# EasyEDA Pro project ProPrj_measure_boardd_2025-05-07.epro

# Schematic Schematic1
Board Name: Board1; Create Date: 2025-02-12; Page Name: P1; Project Name: measure_boardd; Schematic Name: Schematic1; Update Date: 2025-05-06; Company: EasyEDA.com; Page Size: A4; Version: V1.0
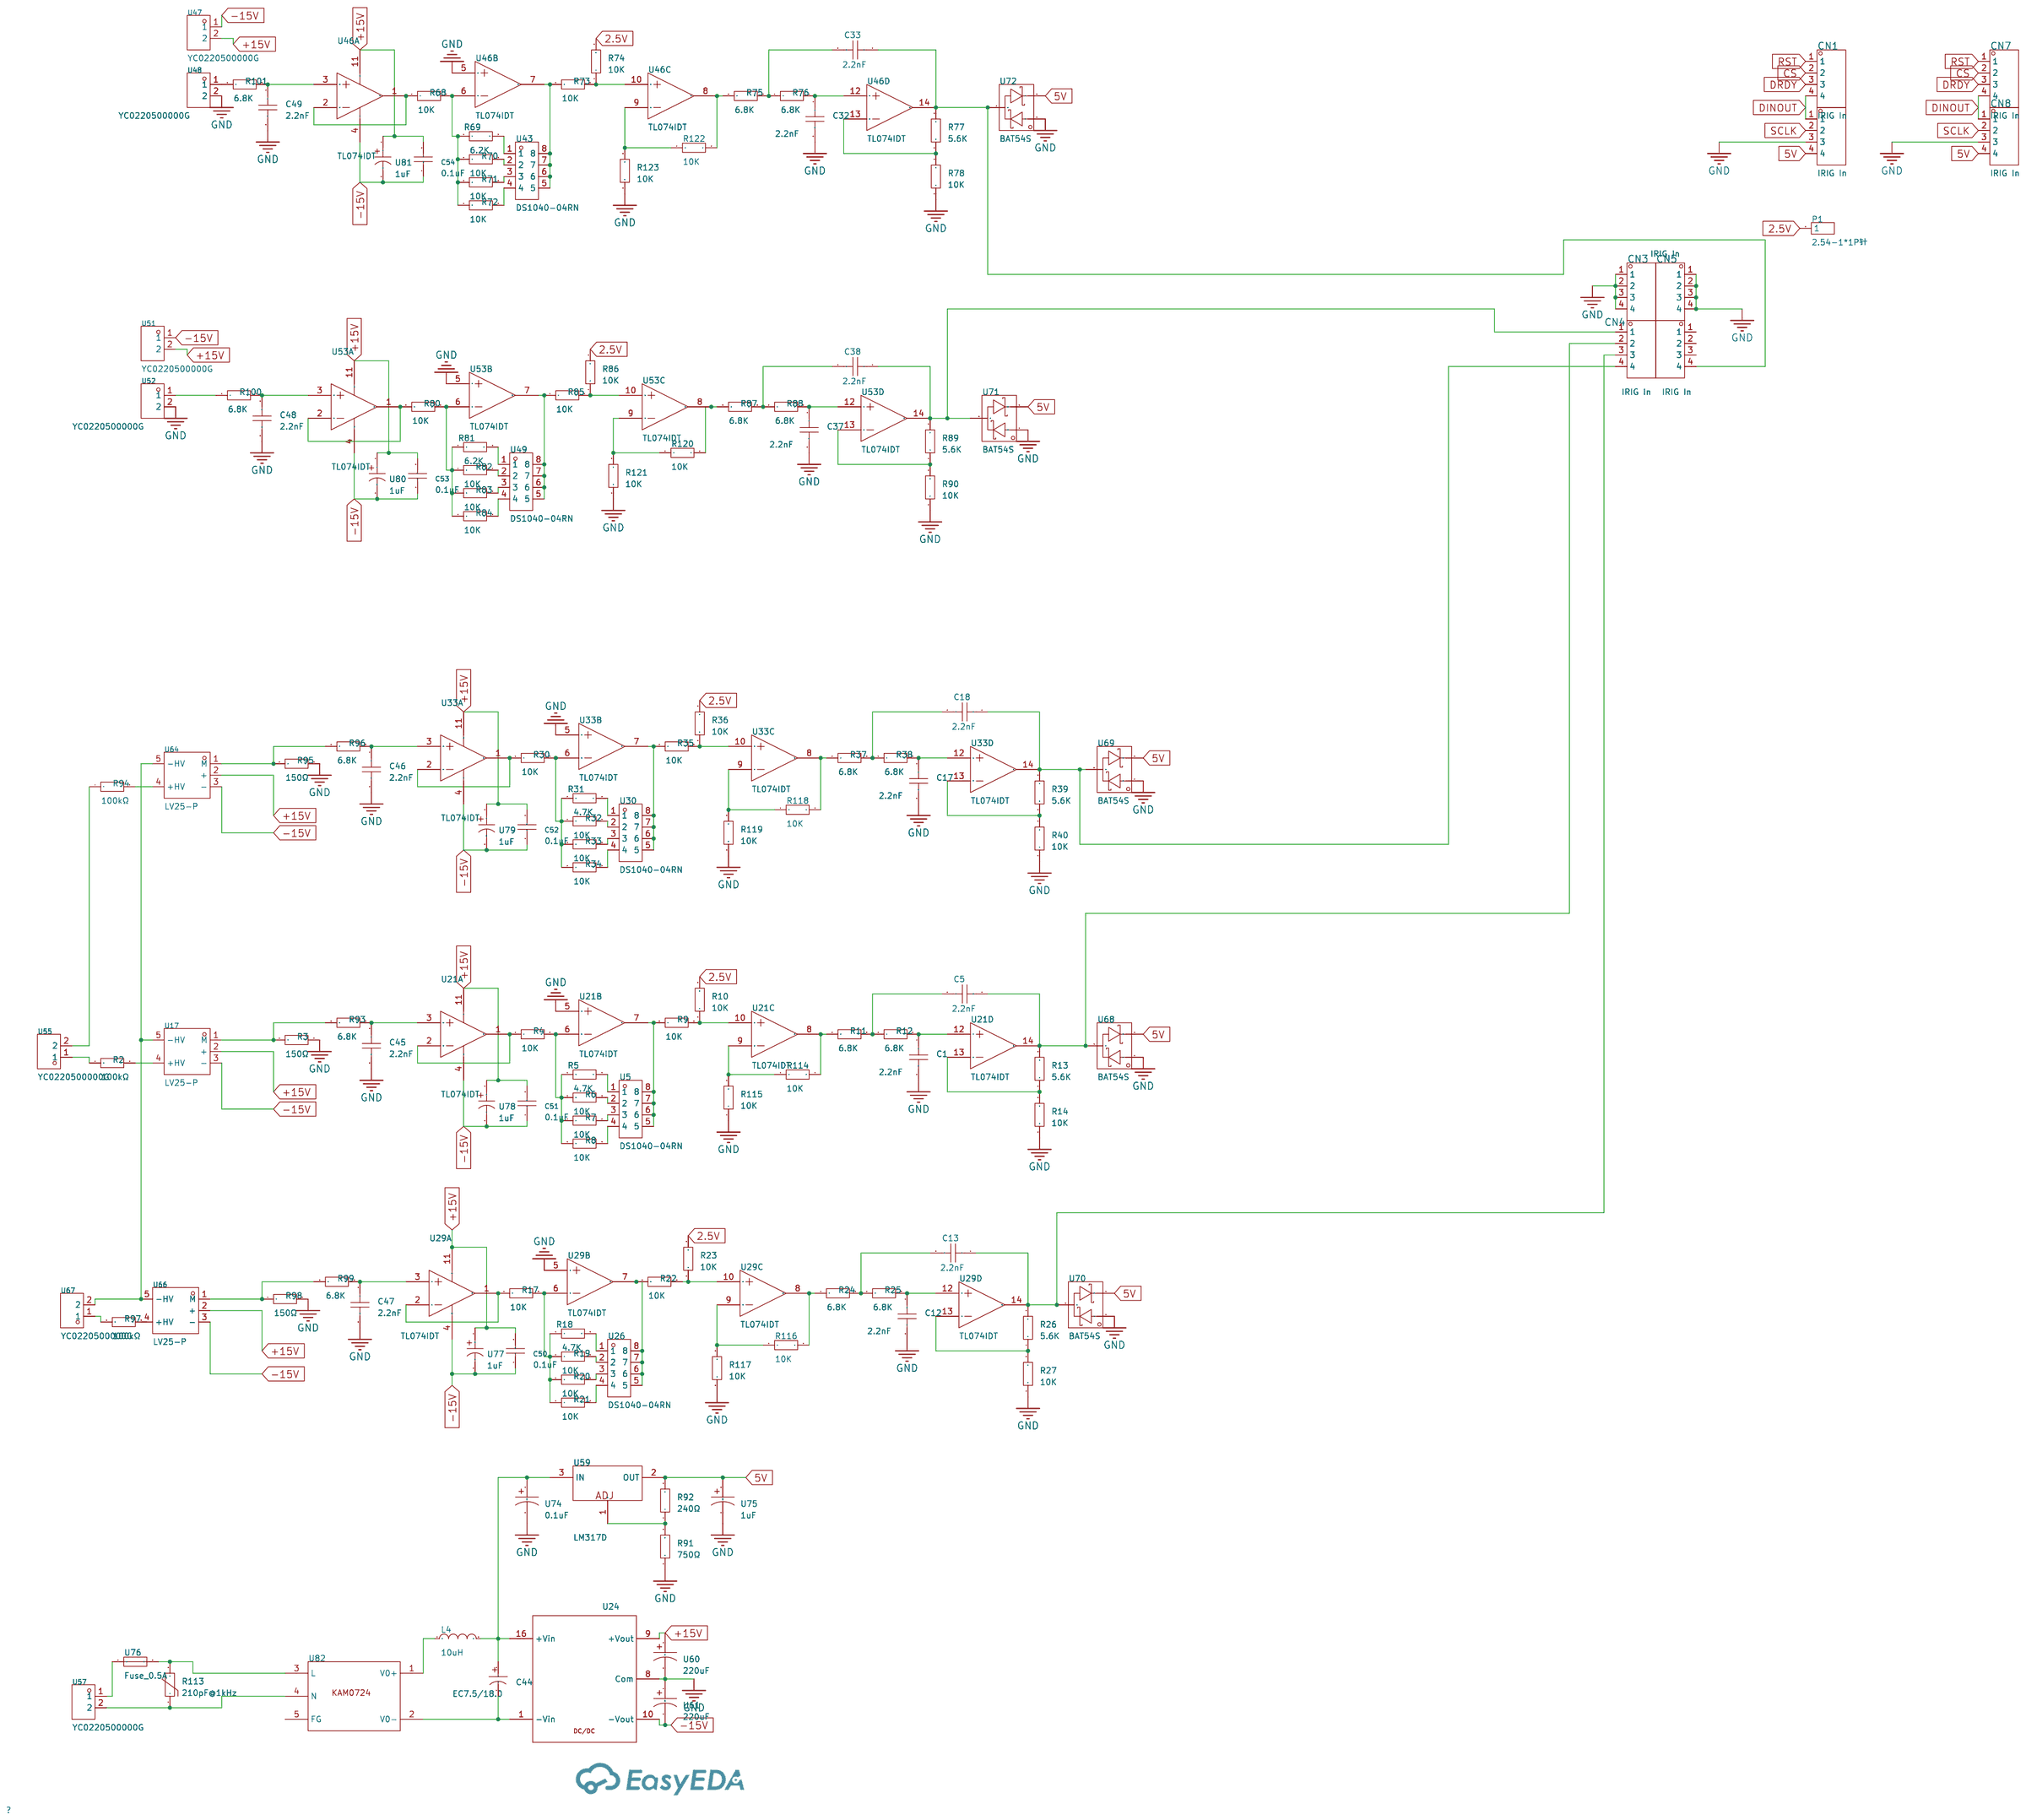
[diagram p0: schematic sheet]

## Parts
C1  2.2nF  [C0805]
C5  2.2nF  [C0805]
C12  2.2nF  [C0805]
C13  2.2nF  [C0805]
C17  2.2nF  [C0805]
C18  2.2nF  [C0805]
C32  2.2nF  [C0805]
C33  2.2nF  [C0805]
C37  2.2nF  [C0805]
C38  2.2nF  [C0805]
C44  EC7.5/18.0  [CAP-TH_BD18.0-P7.50-D1.2-FD]
C45  2.2nF  [C0805]
C46  2.2nF  [C0805]
C47  2.2nF  [C0805]
C48  2.2nF  [C0805]
C49  2.2nF  [C0805]
C50  0.1uF  [C0805]
C51  0.1uF  [C0805]
C52  0.1uF  [C0805]
C53  0.1uF  [C0805]
C54  0.1uF  [C0805]
CN1  IRIG In  [HDR-TH_04P-P2.54-V-M-2]
CN2  IRIG In  [HDR-TH_04P-P2.54-V-M-2]
CN3  IRIG In  [HDR-TH_04P-P2.54-V-M-2]
CN4  IRIG In  [HDR-TH_04P-P2.54-V-M-2]
CN5  IRIG In  [HDR-TH_04P-P2.54-V-M-2]
CN6  IRIG In  [HDR-TH_04P-P2.54-V-M-2]
CN7  IRIG In  [HDR-TH_04P-P2.54-V-M-2]
CN8  IRIG In  [HDR-TH_04P-P2.54-V-M-2]
L4  10uH  [IND-TH_BD9.0-P5.00-D0.7]
P1  2.54-1*1P针  [HDR-TH_1P-P2.54-V-M]
R2  100kΩ  [RES-TH_BD8.0-L24.5-P28.50-D0.8]
R3  150Ω  [R_AXIAL-0.4]
R4  10K  [R0603]
R5  4.7K  [R0603]
R6  10K  [R0603]
R7  10K  [R0603]
R8  10K  [R0603]
R9  10K  [R0603]
R10  10K  [R0603]
R11  6.8K  [R0603]
R12  6.8K  [R0603]
R13  5.6K  [R0603]
R14  10K  [R0603]
R17  10K  [R0603]
R18  4.7K  [R0603]
R19  10K  [R0603]
R20  10K  [R0603]
R21  10K  [R0603]
R22  10K  [R0603]
R23  10K  [R0603]
R24  6.8K  [R0603]
R25  6.8K  [R0603]
R26  5.6K  [R0603]
R27  10K  [R0603]
R30  10K  [R0603]
R31  4.7K  [R0603]
R32  10K  [R0603]
R33  10K  [R0603]
R34  10K  [R0603]
R35  10K  [R0603]
R36  10K  [R0603]
R37  6.8K  [R0603]
R38  6.8K  [R0603]
R39  5.6K  [R0603]
R40  10K  [R0603]
R68  10K  [R0603]
R69  6.2K  [R0603]
R70  10K  [R0603]
R71  10K  [R0603]
R72  10K  [R0603]
R73  10K  [R0603]
R74  10K  [R0603]
R75  6.8K  [R0603]
R76  6.8K  [R0603]
R77  5.6K  [R0603]
R78  10K  [R0603]
R80  10K  [R0603]
R81  6.2K  [R0603]
R82  10K  [R0603]
R83  10K  [R0603]
R84  10K  [R0603]
R85  10K  [R0603]
R86  10K  [R0603]
R87  6.8K  [R0603]
R88  6.8K  [R0603]
R89  5.6K  [R0603]
R90  10K  [R0603]
R91  750Ω  [R1210]
R92  240Ω  [R1210]
R93  6.8K  [R0603]
R94  100kΩ  [RES-TH_BD8.0-L24.5-P28.50-D0.8]
R95  150Ω  [R_AXIAL-0.4]
R96  6.8K  [R0603]
R97  100kΩ  [RES-TH_BD8.0-L24.5-P28.50-D0.8]
R98  150Ω  [R_AXIAL-0.4]
R99  6.8K  [R0603]
R100  6.8K  [R0603]
R101  6.8K  [R0603]
R113  210pF@1kHz  [RES-TH_L12.5-W5.1-P7.50-D1.2-S2.20]
R114  10K  [R0603]
R115  10K  [R0603]
R116  10K  [R0603]
R117  10K  [R0603]
R118  10K  [R0603]
R119  10K  [R0603]
R120  10K  [R0603]
R121  10K  [R0603]
R122  10K  [R0603]
R123  10K  [R0603]
U5  DS1040-04RN  [KEY-TH_DS1040-04RN]
U17  LV25-P  [SENSOR-TH_LV25-P]
U21  TL074IDT  [SOIC-14_L8.7-W3.9-P1.27-LS6.0-BL]  (sections 1,2,3,4)
U24  -  [TEL_8_SERIES]
U26  DS1040-04RN  [KEY-TH_DS1040-04RN]
U29  TL074IDT  [SOIC-14_L8.7-W3.9-P1.27-LS6.0-BL]  (sections 1,2,3,4)
U30  DS1040-04RN  [KEY-TH_DS1040-04RN]
U33  TL074IDT  [SOIC-14_L8.7-W3.9-P1.27-LS6.0-BL]  (sections 1,2,3,4)
U43  DS1040-04RN  [KEY-TH_DS1040-04RN]
U46  TL074IDT  [SOIC-14_L8.7-W3.9-P1.27-LS6.0-BL]  (sections 1,2,3,4)
U47  YC0220500000G  [CONN-TH_YC0220500000G]
U48  YC0220500000G  [CONN-TH_YC0220500000G]
U49  DS1040-04RN  [KEY-TH_DS1040-04RN]
U51  YC0220500000G  [CONN-TH_YC0220500000G]
U52  YC0220500000G  [CONN-TH_YC0220500000G]
U53  TL074IDT  [SOIC-14_L8.7-W3.9-P1.27-LS6.0-BL]  (sections 1,2,3,4)
U55  YC0220500000G  [CONN-TH_YC0220500000G]
U57  YC0220500000G  [CONN-TH_YC0220500000G]
U59  LM317D  [TO-252-2_L6.6-W6.1-P4.57-LS9.9-BR-CW]
U60  220uF  [CAP-TH_BD6.3-P2.50-D0.6-FD]
U61  220uF  [CAP-TH_BD6.3-P2.50-D0.6-FD]
U64  LV25-P  [SENSOR-TH_LV25-P]
U66  LV25-P  [SENSOR-TH_LV25-P]
U67  YC0220500000G  [CONN-TH_YC0220500000G]
U68  BAT54S  [SOT-23-3_L2.9-W1.3-P1.90-LS2.4-BR]
U69  BAT54S  [SOT-23-3_L2.9-W1.3-P1.90-LS2.4-BR]
U70  BAT54S  [SOT-23-3_L2.9-W1.3-P1.90-LS2.4-BR]
U71  BAT54S  [SOT-23-3_L2.9-W1.3-P1.90-LS2.4-BR]
U72  BAT54S  [SOT-23-3_L2.9-W1.3-P1.90-LS2.4-BR]
U74  0.1uF  [CAP-TH_BD6.3-P2.50-D0.6-FD]
U75  1uF  [CAP-TH_BD6.3-P2.50-D0.6-FD]
U76  Fuse_0.5A  [FUSE-TH_L8.9-W2.0-P5.00-D0.6-S0.80]
U77  1uF  [CAP-SMD_L3.5-W2.8-FD]
U78  1uF  [CAP-SMD_L3.5-W2.8-FD]
U79  1uF  [CAP-SMD_L3.5-W2.8-FD]
U80  1uF  [CAP-SMD_L3.5-W2.8-FD]
U81  1uF  [CAP-SMD_L3.5-W2.8-FD]
U82  -  [KAM0724]

## Library data of the parts
C1 C5 C12 C13 C17 C18 C32 C33 C37 C38 C45-C49 = CAP_0805: Supplier Footprint: 0805
C44 = EC7.5/18.0: Supplier Part: C9900017020; Supplier Footprint: 1000uF/63V；间距7.5mm外径18mm; JLCPCB Part Class: Extended Part; Supplier: LCSC
C50-C54 = CL21B105KBFNNNE: Capacitance: Tolerance:±10% Tolerance:±10% Voltage Rated: Temperature Coefficient:; LCSC Part Name: 1uF ±10% 50V; Supplier Part: C28323; Manufacturer: SAMSUNG(三星); Supplier Footprint: 0805; JLCPCB Part Class: Basic Part; Datasheet: https://atta.szlcsc.com/upload/public/pdf/source/20160218/1457707763339.pdf; Supplier: LCSC; Tolerance: ±10%
CN1-CN8 = IRIG In: Supplier: LCSC; Manufacturer Part: Headers  Pins2.54mm1*10P; image: http://image.lceda.cn/szlcsc/C57369.jpg; Supplier Part: C57369
L4 = PK0810-100MB: Inductance: Tolerance:±20% Tolerance:±20% Rated Current:3.2A DC Resistance (DCR):; LCSC Part Name: 10uH ±20%; Supplier Part: C19633499; Manufacturer: SXN(顺翔诺); Supplier Footprint: 插件,D9xL13mm; JLCPCB Part Class: Extended Part; Datasheet: https://atta.szlcsc.com/upload/public/pdf/source/20231215/67ADFEC92998B805DD4A41A71DD3C91A.pdf; Supplier: LCSC; Tolerance: ±20%; Rated Current: 3.2A
P1 = 2.54-1*1P针: Pin Structure:- Pitch:- Row Spacing:- Circluar Pins/Square Pins:- Mounting Type:Straight Number of Rows:Single Row Number of Pins:1P Current Rating:- Voltage Rating (Max):- Length of Mating Pin:- Insulation Height:- Contact Material:- Contact Plating:- Co; LCSC Part Name: 直插; Supplier Part: C81276; Manufacturer: BOOMELE(博穆精密); Supplier Footprint: 插件,P=2.54mm; JLCPCB Part Class: Extended Part; Datasheet: https://atta.szlcsc.com/upload/public/pdf/source/20221018/3E9408392E35E6F57A28985E5F7BF5C9.pdf; Supplier: LCSC; Mounting Type: Straight; Number of Rows: Single Row; Number of Pins: 1P; Color: Black
R2 R94 R97 = Res_AXIAL-5W: Supplier Footprint: Through
R3 R95 R98 = Res_AXIAL-1/4W: Supplier Footprint: Through
R4-R14 R17-R27 R30-R40 R68-R78 R80-R90 R93 R96 R99-R101 R114-R123 = Res_0603: Supplier Footprint: 0603
R91 R92 = Res_1210: Supplier Footprint: 1210
R113 = VDR-10D471K: Varistor Voltage:423V~517V Varistor Voltage:423V~517V Clamping Voltage: Maximum DC Volts: Maximum AC Volts: Peak Current: Energy:67J Energy:67J Capacitance:210pF@1kHz; LCSC Part Name: 钳位电压775V 67焦耳 插件压敏电阻; Supplier Part: C316609; Manufacturer: VDR(嵩隆); Supplier Footprint: 插件; JLCPCB Part Class: Extended Part; Datasheet: https://atta.szlcsc.com/upload/public/pdf/source/20210908/63B170955D01000DCFD7BF012F3B4797.pdf; Supplier: LCSC; Varistor Voltage: 423V~517V; Energy: 67J
U5 U26 U30 U43 U49 = DS1040-04RN: Number of Positions:4Bit Lead Pitch:2.54mm Color:Red; Supplier Part: C3024970; Manufacturer: CONNFLY; Supplier Footprint: 插件; JLCPCB Part Class: Extended Part; Datasheet: https://atta.szlcsc.com/upload/public/pdf/source/20220524/E487E22DEF95345BB2C3C9897C5E0C2D.pdf; Supplier: LCSC; Number of Positions: 4Bit; Lead Pitch: 2.54mm; Color: Red
U17 U64 U66 = LV25-P: Supplier Part: C453476; Manufacturer: LEM(莱姆); Supplier Footprint: 插件; JLCPCB Part Class: Extended Part; Datasheet: https://atta.szlcsc.com/upload/public/pdf/source/20200901/C453476_5BA3BC4F59636857A644FEC5A2FF2FFA.pdf; Supplier: LCSC
U21 U29 U33 U46 U53 = TL074IDT: Number of Circuits:Quad Gain Bandwidth Product(GBP):3MHz Current - Input Bias(Ib):20pA Voltage - Input Offset(Vos):3mV Slew Rate(SR):13V/us Supply Current Per Channel:1.4mA Operating Temperature:-40℃~+105℃ Operating Temperature:-40℃~+105℃; Supplier Part: C107644; Manufacturer: ST(意法半导体); Supplier Footprint: SOIC-14; JLCPCB Part Class: Extended Part; Datasheet: https://atta.szlcsc.com/upload/public/pdf/source/20180511/C79668_B9AF02D8BC6CC04960E26C1CA949D7C5.pdf; Supplier: LCSC; Number of Circuits: Quad; Gain Bandwidth Product(GBP): 3MHz; Current - Input Bias(Ib): 20pA; Voltage - Input Offset(Vos): 3mV; Slew Rate(SR): 13V/us; Supply Current Per Channel: 1.4mA; Operating Temperature: -40℃~+105℃
U24 = TEL_8-2423
U47 U48 U51 U52 U55 U57 U67 = YC0220500000G: Structure:1x2P Pitch:5.08mm Color:Green Mounting Style:Straight Current Rating (Max):10A Voltage Rating (Max):300V Number of Pins:2P Number of Rows:1 Wire Gauge - AWG:16~26 Wire Gauge - AWG:16~26 Number of PINs Per Row:2 Operating Temperature Range:-40℃~+; LCSC Part Name: 5.08mm 1x2P 排数:1 每排P数:2 直插; Supplier Part: C2683165; Manufacturer: Amphenol; Supplier Footprint: 插件,P=5.08mm; JLCPCB Part Class: Extended Part; Datasheet: https://atta.szlcsc.com/upload/public/pdf/source/20210329/C2683165_184F37C3428385EA6CBC65FCC2B0FE9A.pdf; Supplier: LCSC; Structure: 1x2P; Pitch: 5.08mm; Color: Green; Mounting Style: Straight; Current Rating (Max): 10A; Voltage Rating (Max): 300V; Number of Pins: 2P; Number of Rows: 1; Wire Gauge - AWG: 16~26; Number of PINs Per Row: 2; Operating Temperature Range: -40℃~+115℃
U59 = LM317D: Output Type:Adjustable Maximum Input Voltage:- Output Voltage:1.2V~37V Output Voltage:1.2V~37V Output Current:1.5A Power Supply Rejection Ratio (PSRR):80dB@(120Hz) Operating Temperature:0℃~+125℃@(Tj) Operating Temperature:0℃~+125℃@(Tj) Output Polarity:Pos; Supplier Part: C19273122; Manufacturer: YFW(佑风微); Supplier Footprint: TO-252; JLCPCB Part Class: Extended Part; Datasheet: https://atta.szlcsc.com/upload/public/pdf/source/20231201/418A6F2C5017D5AE5FD34272C42A6510.pdf; Supplier: LCSC; Output Type: Adjustable; Output Voltage: 1.2V~37V; Output Current: 1.5A; Power Supply Rejection Ratio (PSRR): 80dB@(120Hz); Operating Temperature: 0℃~+125℃@(Tj); Output Polarity: Positive electrode; Number of Outputs: 1
U60 U61 U74 U75 = 25V220uF CD288: Capacitance: Tolerance:±20% Tolerance:±20% Rated Voltage: Lead Spacing: φD: L: Operating Temperature:-40℃~+105℃ Operating Temperature:-40℃~+105℃; LCSC Part Name: 220uF ±20% 25V; Supplier Part: C2960221; Manufacturer: HRK(鸿瑞凯电子); Supplier Footprint: 插件,D6.3xL12mm; JLCPCB Part Class: Extended Part; Datasheet: https://atta.szlcsc.com/upload/public/pdf/source/20220224/4E62C25599E7046827B6B2B120EB46F9.pdf; Supplier: LCSC; Tolerance: ±20%; Operating Temperature: -40℃~+105℃
U68-U72 = BAT54S_C22374724: Supplier Part: C22374724; Manufacturer: DOWO(东沃); Supplier Footprint: SOT-23; JLCPCB Part Class: Extended Part; Datasheet: https://atta.szlcsc.com/upload/public/pdf/source/20240402/00E7935314739AA8A2B57AD1567A1D2C.pdf; Supplier: LCSC
U76 = Fuse_0.5A: Supplier Part: C9900015003; Supplier Footprint: FUSE_200MIL; JLCPCB Part Class: Extended Part; Supplier: LCSC
U77-U81 = CA45B-B-50V-1UF-K: Capacitance:1uF Tolerance:±10% Tolerance:±10% Voltage Rating:50V Current - Leakage:500nA@25°C,5min Ripple Current:- Equivalent Series Resistance(ESR):6Ω@100kHz Operating Temperature:-55℃~+125℃ Operating Temperature:-55℃~+125℃; LCSC Part Name: 1uF ±10% 50V; Supplier Part: C3202852; Manufacturer: CEC(振华新云); Supplier Footprint: CASE-B-3528-19(mm); JLCPCB Part Class: Extended Part; Datasheet: https://atta.szlcsc.com/upload/public/pdf/source/20220331/9EC1019083AD796DA5C9626021BE8B57.pdf; Supplier: LCSC; Tolerance: ±10%; Voltage Rating: 50V; Current - Leakage: 500nA@25°C,5min; Equivalent Series Resistance(ESR): 6Ω@100kHz; Operating Temperature: -55℃~+125℃
U82 = KAM0724_ver3

## Nets
2.5V: P1.1 R10.2 R23.2 R36.2 R74.2 R86.2
5V: CN2.4 CN8.4 R92.2 U59.2(OUT) U68.2 U69.2 U70.2 U71.2 U72.2 U75.1
+15V: C50.2 C51.2 C52.2 C53.2 C54.2 U17.2(+) U21.11(VCC-) U24.9(+Vout) U29.11(VCC-) U33.11(VCC-) U46.11(VCC-) U47.2 U51.2 U53.11(VCC-) U60.1 U64.2(+) U66.2(+) U77.1 U78.1 U79.1 U80.1 U81.1
-15V: C50.1 C51.1 C52.1 C53.1 C54.1 U17.3(-) U21.4(VCC+) U24.10(-Vout) U29.4(VCC+) U33.4(VCC+) U46.4(VCC+) U47.1 U51.1 U53.4(VCC+) U61.2 U64.3(-) U66.3(-) U77.2 U78.2 U79.2 U80.2 U81.2
GND: C1.2 C12.2 C17.2 C32.2 C37.2 C45.2 C46.2 C47.2 C48.2 C49.2 CN2.3 CN3.1 CN3.2 CN3.3 CN3.4 CN5.1 CN5.2 CN5.3 CN5.4 CN8.3 R3.2 R14.1 R27.1 R40.1 R78.1 R90.1 R91.1 R95.2 R98.2 R115.1 R117.1 R119.1 R121.1 R123.1 U21.5(2IN+) U24.8(Com) U29.5(2IN+) U33.5(2IN+) U46.5(2IN+) U48.2 U52.2 U53.5(2IN+) U60.2 U61.1 U68.1 U69.1 U70.1 U71.1 U72.1 U74.2 U75.2
CS: CN1.2 CN7.2
DINOUT: CN1.4 CN2.1 CN7.4 CN8.1
DRDY: CN1.3 CN7.3
RST: CN1.1 CN7.1
SCLK: CN2.2 CN8.2
$1N1815: R3.1 R93.1 U17.1(M)
$1N1976: R4.1 U21.1(1OUT) U21.2(1IN-)
$1N2054: R5.2 U5.1
$1N2080: R6.2 U5.2
$1N2106: R7.2 U5.3
$1N2182: R8.2 U5.4
$1N2231: R9.1 U5.5 U5.6 U5.7 U5.8 U21.7(2OUT)
$1N2651: R9.2 R10.1 U21.10(3IN+)
$1N3069: C5.2 R11.2 R12.1
$1N3119: C1.1 R12.2 U21.12(4IN+)
$1N3183: R13.1 R14.2 U21.13(4IN-)
$1N3559: R4.2 R5.1 R6.1 R7.1 R8.1 U21.6(2IN-)
$1N4476: C5.1 CN4.2 R13.2 U21.14(4OUT) U68.3
$1N5599: U57.1 U76.1
$1N5603: R113.1 U57.2 U82.4(N)
$1N6524: R17.2 R18.1 R19.1 R20.1 R21.1 U29.6(2IN-)
$1N6525: R18.2 U26.1
$1N6527: R22.1 U26.5 U26.6 U26.7 U26.8 U29.7(2OUT)
$1N6528: R20.2 U26.3
$1N6529: R19.2 U26.2
$1N6533: R21.2 U26.4
$1N6536: R17.1 U29.1(1OUT) U29.2(1IN-)
$1N6538: R22.2 R23.1 U29.10(3IN+)
$1N6541: C13.1 CN4.3 R26.2 U29.14(4OUT) U70.3
$1N6548: R26.1 R27.2 U29.13(4IN-)
$1N6553: C13.2 R24.2 R25.1
$1N6559: C12.1 R25.2 U29.12(4IN+)
$1N7416: R30.2 R31.1 R32.1 R33.1 R34.1 U33.6(2IN-)
$1N7417: R31.2 U30.1
$1N7419: R35.1 U30.5 U30.6 U30.7 U30.8 U33.7(2OUT)
$1N7420: R33.2 U30.3
$1N7421: R32.2 U30.2
$1N7425: R34.2 U30.4
$1N7428: R30.1 U33.1(1OUT) U33.2(1IN-)
$1N7430: R35.2 R36.1 U33.10(3IN+)
$1N7440: R39.1 R40.2 U33.13(4IN-)
$1N7445: C18.2 R37.2 R38.1
$1N7451: C17.1 R38.2 U33.12(4IN+)
$1N10154: R72.2 U43.4
$1N10155: R68.2 R69.1 R70.1 R71.1 R72.1 U46.6(2IN-)
$1N10156: R73.1 U43.5 U43.6 U43.7 U43.8 U46.7(2OUT)
$1N10157: R71.2 U43.3
$1N10158: R70.2 U43.2
$1N10167: C33.2 R75.2 R76.1
$1N10180: R69.2 U43.1
$1N10182: R68.1 U46.1(1OUT) U46.2(1IN-)
$1N10186: R77.1 R78.2 U46.13(4IN-)
$1N10198: C32.1 R76.2 U46.12(4IN+)
$1N10199: R73.2 R74.1 U46.10(3IN+)
$1N17336: R113.2 U76.2 U82.3(L)
$1N20202: R80.1 U53.1(1OUT) U53.2(1IN-)
$1N20203: R81.2 U49.1
$1N20204: R82.2 U49.2
$1N20205: R83.2 U49.3
$1N20206: R84.2 U49.4
$1N20207: R85.1 U49.5 U49.6 U49.7 U49.8 U53.7(2OUT)
$1N20209: R85.2 R86.1 U53.10(3IN+)
$1N20211: C38.2 R87.2 R88.1
$1N20212: C37.1 R88.2 U53.12(4IN+)
$1N20213: R89.1 R90.2 U53.13(4IN-)
$1N20216: R80.2 R81.1 R82.1 R83.1 R84.1 U53.6(2IN-)
$1N20370: R2.1 U55.1
$1N20734: R91.2 R92.1 U59.1(ADJ)
$1N23806: C44.2 U24.1(-Vin) U82.2(V0-)
$1N36258: L4.1 U82.1(V0+)
$1N36284: C44.1 L4.2 U24.16(+Vin) U59.3(IN) U74.1
$1N41392: C45.1 R93.2 U21.3(1IN+)
$1N41681: C46.1 R96.2 U33.3(1IN+)
$1N41683: U17.5(-HV) U64.5(-HV) U66.5(-HV) U67.2
$1N41685: R95.1 R96.1 U64.1(M)
$1N42087: R98.1 R99.1 U66.1(M)
$1N42093: R97.2 U66.4(+HV)
$1N42100: C47.1 R99.2 U29.3(1IN+)
$1N42167: C48.1 R100.2 U53.3(1IN+)
$1N42170: R100.1 U52.1
$1N42233: C49.1 R101.2 U46.3(1IN+)
$1N42236: R101.1 U48.1
$1N84415: R94.2 U64.4(+HV)
$1N84418: R94.1 U55.2
$1N84441: R2.2 U17.4(+HV)
$1N84474: R97.1 U67.1
$1N102670: C18.1 CN4.4 R39.2 U33.14(4OUT) U69.3
$1N108532: C33.1 CN6.4 R77.2 U46.14(4OUT) U72.3
$1N108540: C38.1 CN4.1 R89.2 U53.14(4OUT) U71.3
$1N114348: R114.1 R115.2 U21.9(3IN-)
$1N114352: R11.1 R114.2 U21.8(3OUT)
$1N114492: R116.1 R117.2 U29.9(3IN-)
$1N114496: R24.1 R116.2 U29.8(3OUT)
$1N114708: R122.1 R123.2 U46.9(3IN-)
$1N114712: R75.1 R122.2 U46.8(3OUT)
$1N114721: R120.1 R121.2 U53.9(3IN-)
$1N114725: R87.1 R120.2 U53.8(3OUT)
$1N114740: R118.1 R119.2 U33.9(3IN-)
$1N114744: R37.1 R118.2 U33.8(3OUT)

Not connected (* = marked no-connect by the designer): CN6 1 2 3; U82 5(FG)

# Board PCB1
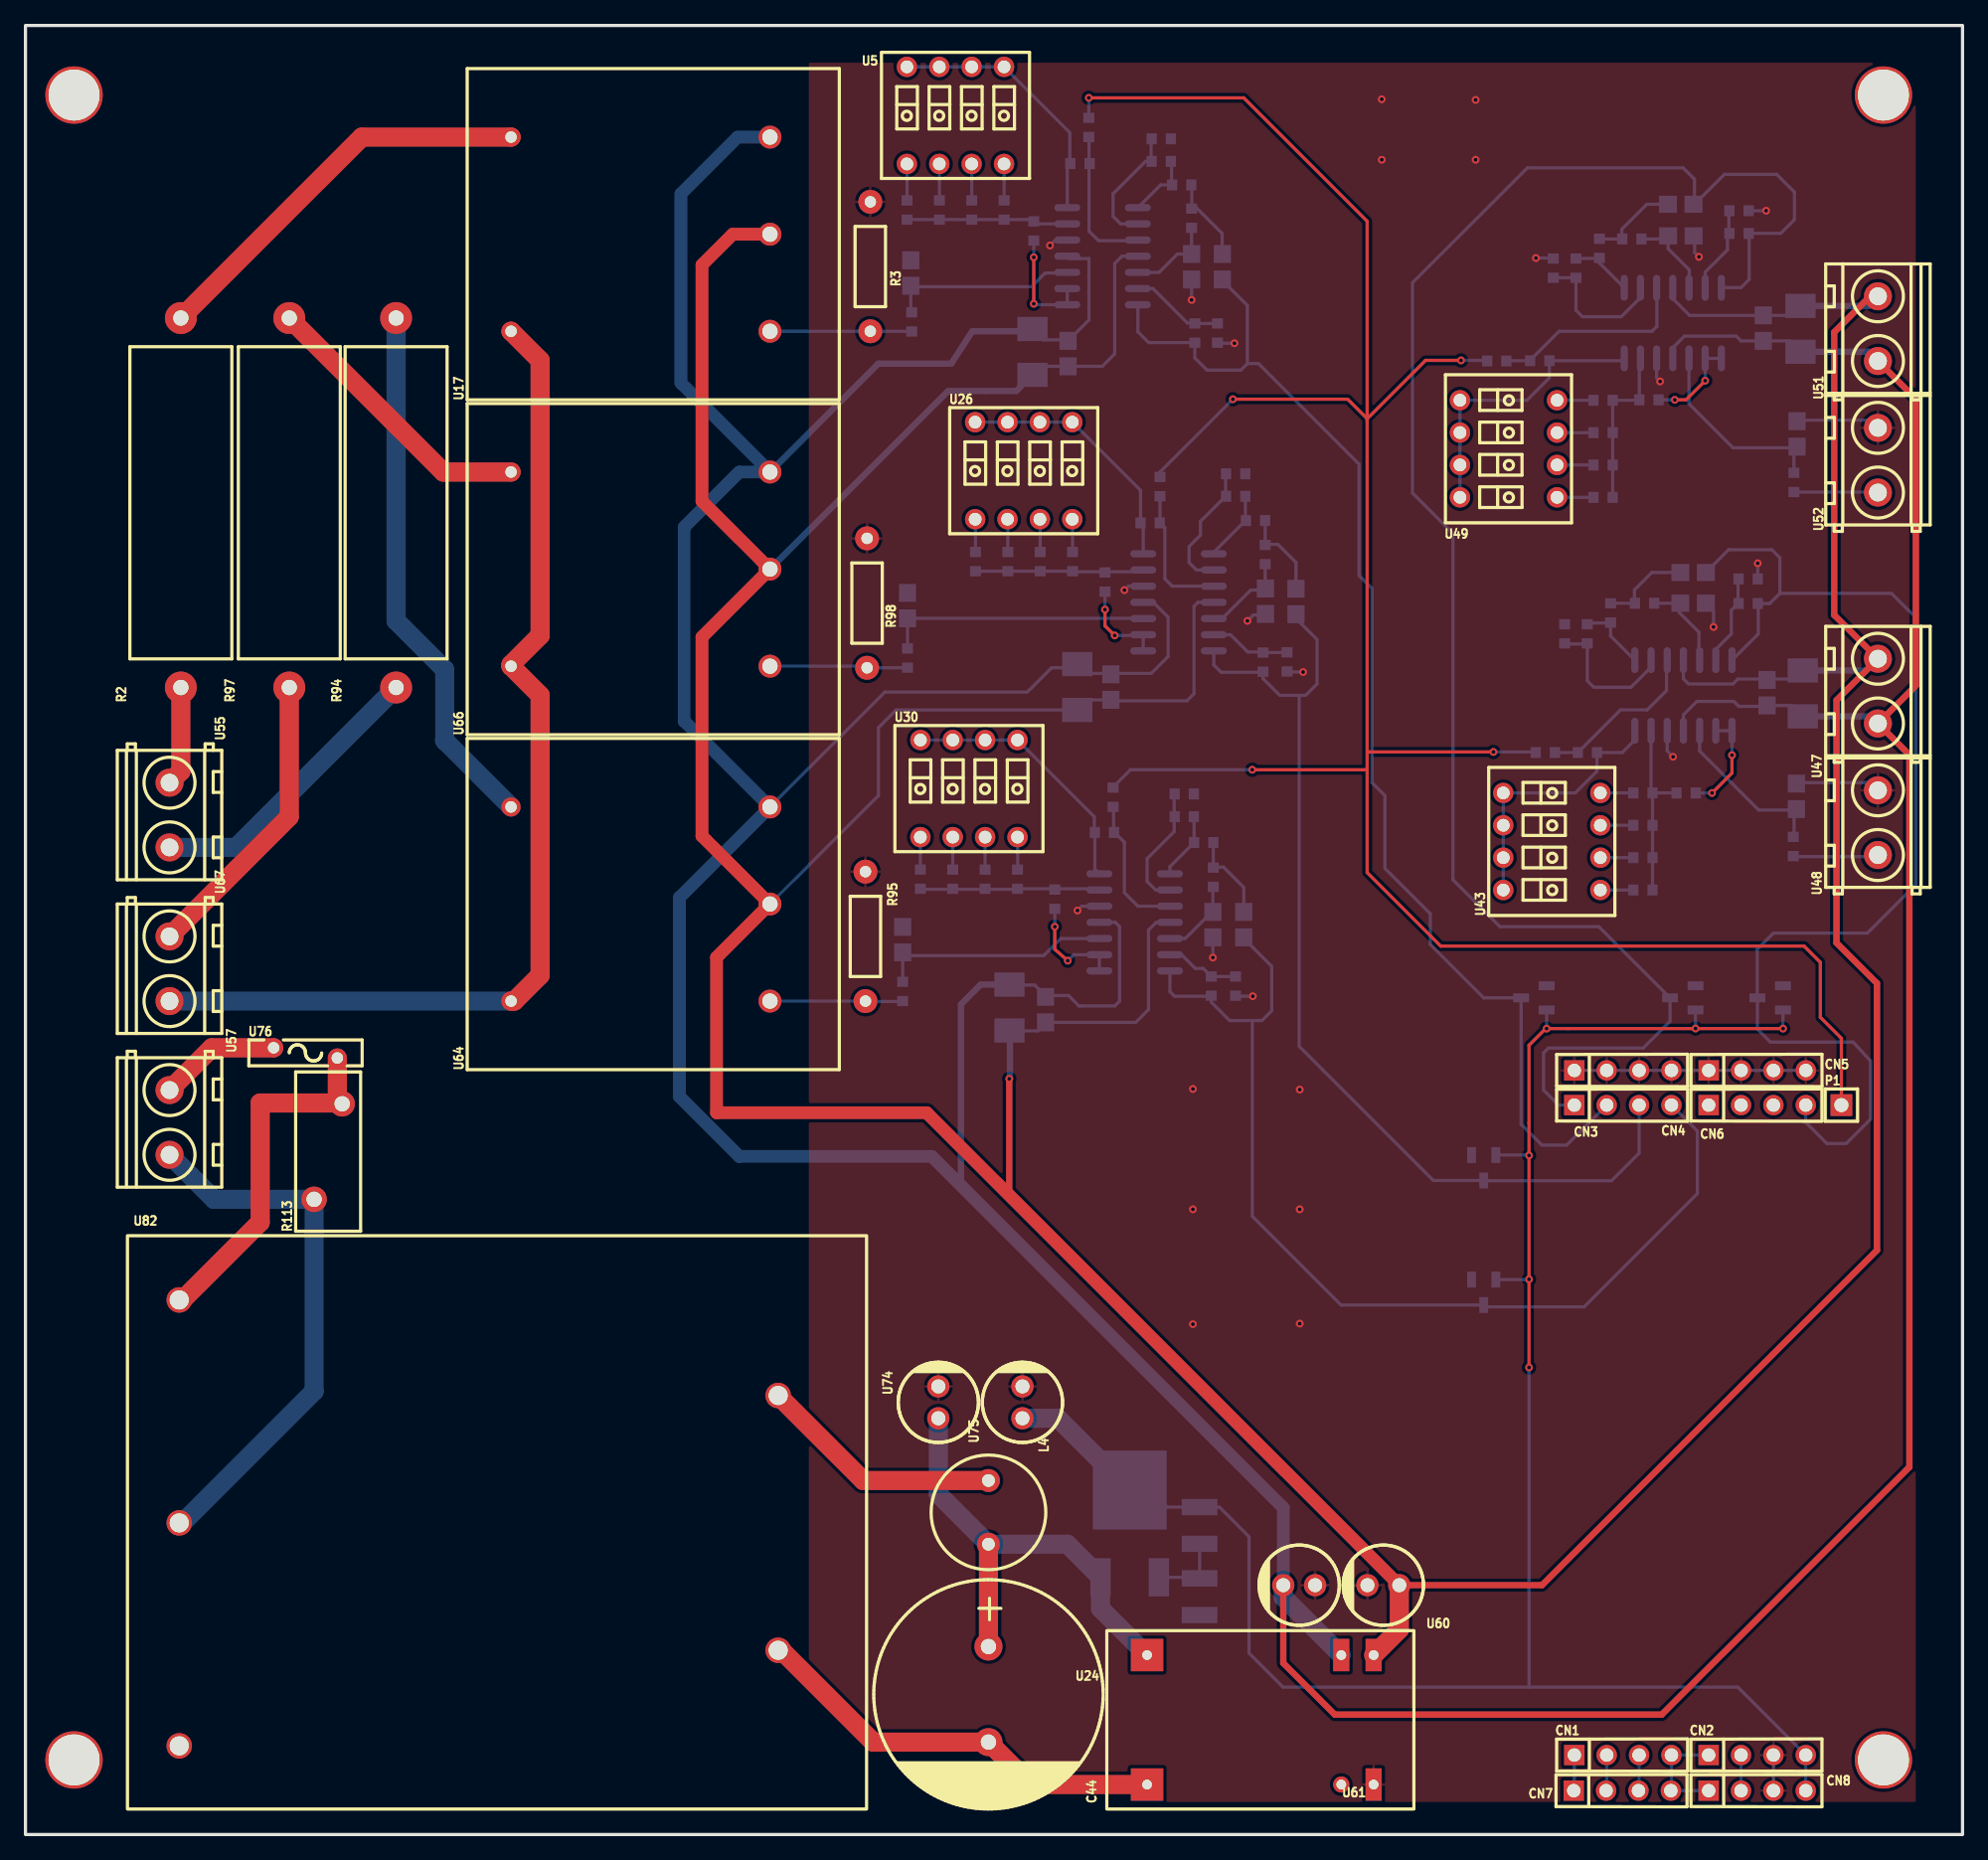
[diagram p1: board, top side]
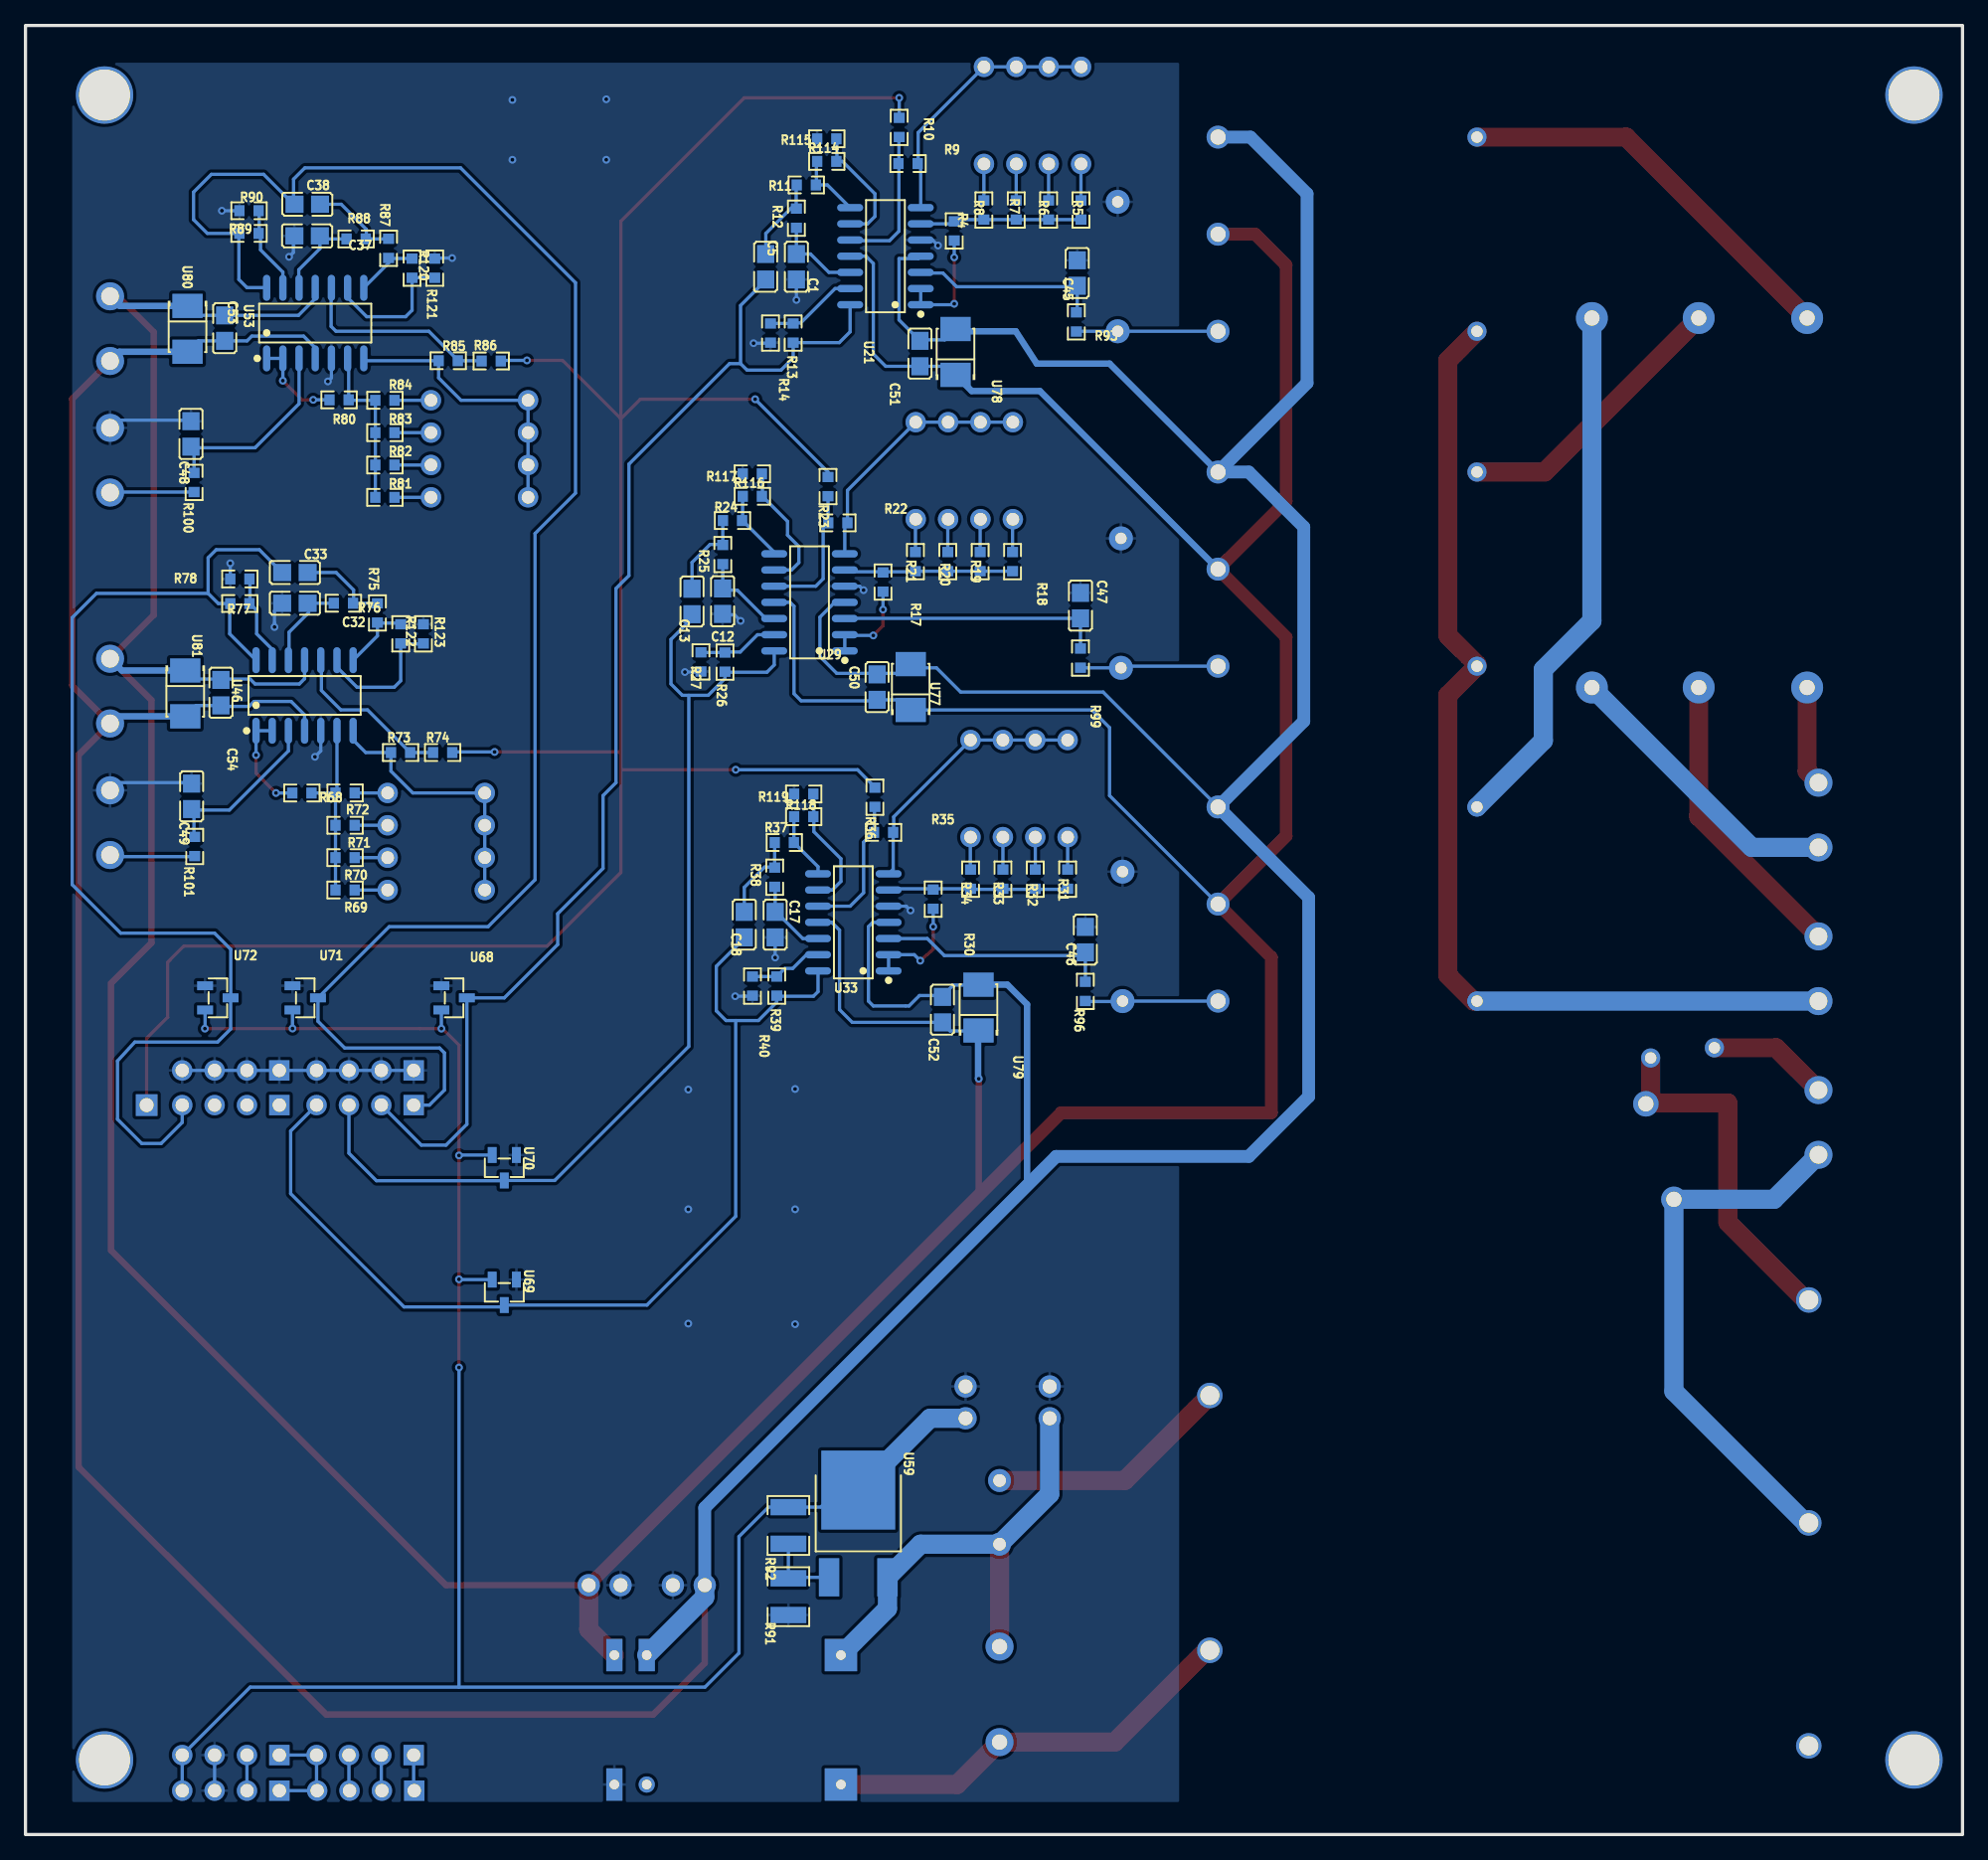
[diagram p2: board, bottom side, seen from below]

Outline 152 x 142 mm; copper layers: Top Layer, Bottom Layer. Coordinates in mm from the lower left corner of the outline.
Outline path: rectangle 0,142 152,0
Stack: Top Layer 0.035mm / Dielectric1 1.51mm FR4 er 4.5 / Bottom Layer 0.035mm

## Design rules (mm)
template: JLCPCB Capability(Two Layers Board)
spacing copperThickness1oz (default): track to track 0.102, other pairs 0.152 to 0.3
spacing copperThickness2oz: track to track 0.203, other pairs 0.152 to 0.3
track width copperThickness1oz (default): min 0.127, default 0.254, max 2.54
track width copperThickness2oz: min 0.203, default 0.254, max 2.54
differential pair differentialPair (default): width min 0.127, default 0.254, max 2.54; gap min 0.152, default 0.152
via viaSize (default): diameter min 0.5, default 0.61, max 10; hole min 0.3, default 0.305, max 6.3

## Placement (name value [footprint] x y rotation side)
C1  2.2nF  [C0805]  91.51 123.06 270 bottom
C5  2.2nF  [C0805]  93.92 123.06 90 bottom
C12  2.2nF  [C0805]  97.3 96.81 270 bottom
C13  2.2nF  [C0805]  99.69 96.79 90 bottom
C17  2.2nF  [C0805]  93.17 71.42 270 bottom
C18  2.2nF  [C0805]  95.6 71.42 90 bottom
C32  2.2nF  [C0805]  130.86 96.65 0 bottom
C33  2.2nF  [C0805]  130.86 99.06 180 bottom
C37  2.2nF  [C0805]  129.9 125.49 0 bottom
C38  2.2nF  [C0805]  129.89 127.97 180 bottom
C44  EC7.5/18.0  [CAP-TH_BD18.0-P7.50-D1.2-FD]  75.56 11 270 top
C45  2.2nF  [C0805]  69.47 122.57 90 bottom
C46  2.2nF  [C0805]  68.83 70.25 90 bottom
C47  2.2nF  [C0805]  69.22 96.46 90 bottom
C48  2.2nF  [C0805]  139.01 109.94 90 bottom
C49  2.2nF  [C0805]  138.97 81.49 90 bottom
C50  0.1uF  [C0805]  85.17 90.07 270 bottom
C51  0.1uF  [C0805]  81.81 116.25 270 bottom
C52  0.1uF  [C0805]  80.04 64.75 270 bottom
C53  0.1uF  [C0805]  136.37 118.24 90 bottom
C54  0.1uF  [C0805]  136.66 89.63 90 bottom
CN1  IRIG In  [HDR-TH_04P-P2.54-V-M-2]  126.62 6.24 0 top
CN2  IRIG In  [HDR-TH_04P-P2.54-V-M-2]  137.16 6.24 0 top
CN3  IRIG In  [HDR-TH_04P-P2.54-V-M-2]  126.62 59.98 0 top
CN4  IRIG In  [HDR-TH_04P-P2.54-V-M-2]  126.62 57.26 0 top
CN5  IRIG In  [HDR-TH_04P-P2.54-V-M-2]  137.16 59.98 0 top
CN6  IRIG In  [HDR-TH_04P-P2.54-V-M-2]  137.16 57.26 0 top
CN7  IRIG In  [HDR-TH_04P-P2.54-V-M-2]  126.57 3.44 0 top
CN8  IRIG In  [HDR-TH_04P-P2.54-V-M-2]  137.16 3.44 0 top
L4  10uH  [IND-TH_BD9.0-P5.00-D0.7]  75.56 25.29 270 top
NOREF  -  [Pad_e221]  145.8 5.86 0 top
NOREF#2  -  [Pad_e224]  145.8 136.54 0 top
NOREF#3  -  [Pad_e222]  3.81 5.86 0 top
NOREF#4  -  [Pad_e223]  3.81 136.54 0 top
P1  2.54-1*1P针  [HDR-TH_1P-P2.54-V-M]  142.49 57.26 0 top
R2  100kΩ  [RES-TH_BD8.0-L24.5-P28.50-D0.8]  12.19 104.53 90 top
R3  150Ω  [R_AXIAL-0.4]  66.29 123.08 90 top
R4  10K  [R0603]  79.12 125.87 90 bottom
R5  4.7K  [R0603]  69.18 127.52 90 bottom
R6  10K  [R0603]  71.72 127.52 90 bottom
R7  10K  [R0603]  74.26 127.52 90 bottom
R8  10K  [R0603]  76.8 127.52 90 bottom
R9  10K  [R0603]  82.74 131.16 0 bottom
R10  10K  [R0603]  83.44 134 90 bottom
R11  6.8K  [R0603]  90.73 129.48 0 bottom
R12  6.8K  [R0603]  91.51 126.87 270 bottom
R13  5.6K  [R0603]  91.76 117.86 270 bottom
R14  10K  [R0603]  93.54 117.86 90 bottom
R17  10K  [R0603]  84.71 98.31 90 bottom
R18  4.7K  [R0603]  74.55 99.92 90 bottom
R19  10K  [R0603]  77.09 99.92 90 bottom
R20  10K  [R0603]  79.63 99.92 90 bottom
R21  10K  [R0603]  82.17 99.92 90 bottom
R22  10K  [R0603]  88.25 102.96 0 bottom
R23  10K  [R0603]  89.03 105.81 90 bottom
R24  6.8K  [R0603]  96.52 103.14 0 bottom
R25  6.8K  [R0603]  97.28 100.47 270 bottom
R26  5.6K  [R0603]  97.11 92.03 270 bottom
R27  10K  [R0603]  98.99 92.04 90 bottom
R30  10K  [R0603]  80.77 73.42 90 bottom
R31  4.7K  [R0603]  70.22 74.99 90 bottom
R32  10K  [R0603]  72.76 74.99 90 bottom
R33  10K  [R0603]  75.3 74.99 90 bottom
R34  10K  [R0603]  77.84 74.99 90 bottom
R35  10K  [R0603]  84.67 78.66 0 bottom
R36  10K  [R0603]  85.34 81.42 90 bottom
R37  6.8K  [R0603]  92.46 77.87 0 bottom
R38  6.8K  [R0603]  93.21 75.14 270 bottom
R39  5.6K  [R0603]  93.05 66.6 270 bottom
R40  10K  [R0603]  94.95 66.6 90 bottom
R68  10K  [R0603]  130.31 81.75 180 bottom
R69  6.2K  [R0603]  126.92 74.14 180 bottom
R70  10K  [R0603]  126.92 76.68 180 bottom
R71  10K  [R0603]  126.92 79.22 180 bottom
R72  10K  [R0603]  126.92 81.76 180 bottom
R73  10K  [R0603]  122.57 84.93 180 bottom
R74  10K  [R0603]  119.26 84.93 180 bottom
R75  6.8K  [R0603]  124.38 95.89 90 bottom
R76  6.8K  [R0603]  127.05 96.65 0 bottom
R77  5.6K  [R0603]  135.18 96.62 0 bottom
R78  10K  [R0603]  135.18 98.55 180 bottom
R80  10K  [R0603]  127.39 112.62 180 bottom
R81  6.2K  [R0603]  123.79 104.96 180 bottom
R82  10K  [R0603]  123.79 107.5 180 bottom
R83  10K  [R0603]  123.79 110.04 180 bottom
R84  10K  [R0603]  123.79 112.58 180 bottom
R85  10K  [R0603]  118.83 115.69 180 bottom
R86  10K  [R0603]  115.45 115.66 180 bottom
R87  6.8K  [R0603]  123.51 124.51 90 bottom
R88  6.8K  [R0603]  126.05 125.24 0 bottom
R89  5.6K  [R0603]  134.46 125.68 0 bottom
R90  10K  [R0603]  134.46 127.46 180 bottom
R91  750Ω  [R1210]  92.13 18.67 90 bottom
R92  240Ω  [R1210]  92.13 24.26 90 bottom
R93  6.8K  [R0603]  69.54 118.73 90 bottom
R94  100kΩ  [RES-TH_BD8.0-L24.5-P28.50-D0.8]  29.08 104.53 90 top
R95  150Ω  [R_AXIAL-0.4]  65.91 70.5 90 top
R96  6.8K  [R0603]  68.83 66.18 90 bottom
R97  100kΩ  [RES-TH_BD8.0-L24.5-P28.50-D0.8]  20.7 104.53 90 top
R98  150Ω  [R_AXIAL-0.4]  66.04 96.66 90 top
R99  6.8K  [R0603]  69.22 92.34 90 bottom
R100  6.8K  [R0603]  138.77 106.13 90 bottom
R101  6.8K  [R0603]  138.72 77.56 90 bottom
R113  210pF@1kHz  [RES-TH_L12.5-W5.1-P7.50-D1.2-S2.20]  23.75 53.61 90 top
R114  10K  [R0603]  89.12 131.33 0 bottom
R115  10K  [R0603]  89.12 133.11 180 bottom
R116  10K  [R0603]  94.97 105.04 0 bottom
R117  10K  [R0603]  94.97 106.81 180 bottom
R118  10K  [R0603]  90.93 79.9 0 bottom
R119  10K  [R0603]  90.93 81.67 180 bottom
R120  10K  [R0603]  121.67 122.95 90 bottom
R121  10K  [R0603]  119.89 122.95 270 bottom
R122  10K  [R0603]  122.56 94.25 90 bottom
R123  10K  [R0603]  120.78 94.25 270 bottom
U5  DS1040-04RN  [KEY-TH_DS1040-04RN]  72.98 134.94 0 top
U17  LV25-P  [SENSOR-TH_LV25-P]  48.26 125.62 90 top
U21  TL074IDT  [SOIC-14_L8.7-W3.9-P1.27-LS6.0-BL]  84.52 123.89 90 bottom
U24  -  [TEL_8_SERIES]  88.01 9 0 top
U26  DS1040-04RN  [KEY-TH_DS1040-04RN]  78.33 107.05 0 top
U29  TL074IDT  [SOIC-14_L8.7-W3.9-P1.27-LS6.0-BL]  90.48 96.72 90 bottom
U30  DS1040-04RN  [KEY-TH_DS1040-04RN]  74.03 82.1 0 top
U33  TL074IDT  [SOIC-14_L8.7-W3.9-P1.27-LS6.0-BL]  87.04 71.6 90 bottom
U43  DS1040-04RN  [KEY-TH_DS1040-04RN]  119.77 77.95 90 top
U46  TL074IDT  [SOIC-14_L8.7-W3.9-P1.27-LS6.0-BL]  130.1 89.41 180 bottom
U47  YC0220500000G  [CONN-TH_YC0220500000G]  145.36 89.75 90 top
U48  YC0220500000G  [CONN-TH_YC0220500000G]  145.36 79.43 90 top
U49  DS1040-04RN  [KEY-TH_DS1040-04RN]  116.37 108.77 90 top
U51  YC0220500000G  [CONN-TH_YC0220500000G]  145.36 118.2 90 top
U52  YC0220500000G  [CONN-TH_YC0220500000G]  145.36 107.88 90 top
U53  TL074IDT  [SOIC-14_L8.7-W3.9-P1.27-LS6.0-BL]  129.26 118.64 180 bottom
U55  YC0220500000G  [CONN-TH_YC0220500000G]  11.3 80.02 270 top
U57  YC0220500000G  [CONN-TH_YC0220500000G]  11.3 55.89 270 top
U59  LM317D  [TO-252-2_L6.6-W6.1-P4.57-LS9.9-BR-CW]  86.65 23.61 270 bottom
U60  220uF  [CAP-TH_BD6.3-P2.50-D0.6-FD]  106.55 19.57 180 top
U61  220uF  [CAP-TH_BD6.3-P2.50-D0.6-FD]  99.95 19.57 180 top
U64  LV25-P  [SENSOR-TH_LV25-P]  48.26 73.04 90 top
U66  LV25-P  [SENSOR-TH_LV25-P]  48.26 99.33 90 top
U67  YC0220500000G  [CONN-TH_YC0220500000G]  11.3 67.96 270 top
U68  BAT54S  [SOT-23-3_L2.9-W1.3-P1.90-LS2.4-BR]  118.36 65.67 0 bottom
U69  BAT54S  [SOT-23-3_L2.9-W1.3-P1.90-LS2.4-BR]  114.43 42.56 90 bottom
U70  BAT54S  [SOT-23-3_L2.9-W1.3-P1.90-LS2.4-BR]  114.43 52.34 90 bottom
U71  BAT54S  [SOT-23-3_L2.9-W1.3-P1.90-LS2.4-BR]  130.05 65.67 0 bottom
U72  BAT54S  [SOT-23-3_L2.9-W1.3-P1.90-LS2.4-BR]  136.91 65.67 0 bottom
U74  0.1uF  [CAP-TH_BD6.3-P2.50-D0.6-FD]  71.63 33.92 90 top
U75  1uF  [CAP-TH_BD6.3-P2.50-D0.6-FD]  78.23 33.92 90 top
U76  Fuse_0.5A  [FUSE-TH_L8.9-W2.0-P5.00-D0.6-S0.80]  21.97 61.36 0 top
U77  1uF  [CAP-SMD_L3.5-W2.8-FD]  82.53 90.07 90 bottom
U78  1uF  [CAP-SMD_L3.5-W2.8-FD]  79.02 116.37 90 bottom
U79  1uF  [CAP-SMD_L3.5-W2.8-FD]  77.22 64.91 90 bottom
U80  1uF  [CAP-SMD_L3.5-W2.8-FD]  139.29 118.19 270 bottom
U81  1uF  [CAP-SMD_L3.5-W2.8-FD]  139.46 89.57 270 bottom
U82  -  [KAM0724]  107.7 -15.23 0 top

## Footprints (pads in the part's own frame, mm; a bottom-side part is the same pattern mirrored in y, then rotated)
C0805
  rect 1.41x1.35 smd: 1(-1,0) 2(1,0)
CAP-SMD_L3.5-W2.8-FD
  rect 1.9x2.376 smd: 1(-1.798,0) 2(1.798,0)
CAP-TH_BD6.3-P2.50-D0.6-FD
  round 1.75 hole 1.1: 1(-1.25,0) 2(1.25,0)
CAP-TH_BD18.0-P7.50-D1.2-FD
  round 2.2 hole 1.2: 1(-3.75,0) 2(3.75,0)
CONN-TH_YC0220500000G
  round 2.2 hole 1.4: 1(-2.54,0) 2(2.54,0)
FUSE-TH_L8.9-W2.0-P5.00-D0.6-S0.80
  round 1.5 hole 0.9: 1(-2.5,0.4) 2(2.5,-0.4)
HDR-TH_1P-P2.54-V-M
  rect 1.7x1.7 hole 1.1: 1(0,0)
HDR-TH_04P-P2.54-V-M-2
  rect 1.6x1.6 hole 1.05: 1(-5.08,0)
  round 1.6 hole 1.05: 2(-2.54,0) 3(0,0) 4(2.54,0)
IND-TH_BD9.0-P5.00-D0.7
  round 1.8 hole 1: 1(-2.5,0) 2(2.5,0)
KAM0724
  round 2 hole 1.5: 1(-48.631,49.688) 2(-48.631,29.688) 3(-95.631,57.188) 4(-95.631,39.688) 5(-95.631,22.188)
KEY-TH_DS1040-04RN
  round 1.6 hole 1: 1(-3.81,-3.81) 2(-1.27,-3.81) 3(1.27,-3.81) 4(3.81,-3.81) 5(3.81,3.81) 6(1.27,3.81) 7(-1.27,3.81) 8(-3.81,3.81)
Pad_e221
  round 4.5 hole 4: 1(0,0)
Pad_e222
  round 4.5 hole 4: 2(0,0)
Pad_e223
  round 4.5 hole 4: 3(0,0)
Pad_e224
  round 4.5 hole 4: 4(0,0)
R0603
  rect 0.806x0.864 smd: 1(-0.753,0) 2(0.753,0)
R1210
  rect 1.282x2.808 smd: 1(-1.441,0) 2(1.441,0)
R_AXIAL-0.4
  round 1.879 hole 0.899: 1(-5.08,0) 2(5.08,0)
RES-TH_BD8.0-L24.5-P28.50-D0.8
  round 2.5 hole 1.2: 1(-14.5,0) 2(14.5,0)
RES-TH_L12.5-W5.1-P7.50-D1.2-S2.20
  round 2 hole 1.2: 1(-3.749,1.1) 2(3.749,-1.1)
SENSOR-TH_LV25-P
  round 1.8 hole 1.2: 1(-7.62,-10.16) 2(0,-10.16) 3(7.62,-10.16)
  round 1.5 hole 0.9: 4(7.62,10.16) 5(-7.62,10.16)
SOIC-14_L8.7-W3.9-P1.27-LS6.0-BL
  oval 0.574x2.038 smd: 1(-3.81,-2.769) 2(-2.54,-2.769) 3(-1.27,-2.769) 4(0,-2.769) 5(1.27,-2.769) 6(2.54,-2.769) 7(3.81,-2.769) 8(3.81,2.769) 9(2.54,2.769) 10(1.27,2.769) 11(0,2.769) 12(-1.27,2.769) 13(-2.54,2.769) 14(-3.81,2.769)
SOT-23-3_L2.9-W1.3-P1.90-LS2.4-BR
  rect 1.25x0.7 smd: 1(1,-0.95) 2(1,0.95) 3(-1,0)
TEL_8_SERIES
  rect 2.54x2.54 hole 0.762: 1(0,-5.08) 16(0,5.08)
  round 1.27 hole 0.762: 7(15.24,-5.08)
  rect 1.27x2.54 hole 0.762: 8(17.78,-5.08) 9(17.78,5.08) 10(15.24,5.08)
TO-252-2_L6.6-W6.1-P4.57-LS9.9-BR-CW
  rect 3x1.6 smd: 1(3.424,-2.29) 3(3.424,2.29)
  rect 6.2x5.8 smd: 2(-3.424,0)

## Nets
As in the schematic.

Pads without a net: CN6 1 2 3; NOREF 1; NOREF#2 4; NOREF#3 2; NOREF#4 3; U24 7; U82 5

## Via types
v1: diameter 0.61, hole 0.305, Top Layer to Bottom Layer, 48 vias

## Routing (per net, layer and track width the routed paths; a pad name or vN(x,y) marks a point on that pad's centre or on a via; arc(x,y) is an arc through that point)
2.5V: length 193.8
  Top Layer w0.254: v1(83.44,136.32) 95.6,136.32 105.28,126.63 105.28,110.92 ; v1(96.27,83.58) 105.28,83.58 ; v1(94.74,112.66) 103.76,112.66 105.28,111.14 ; 105.28,111.14 105.28,75.51 111.05,69.74 139.57,69.74 140.84,68.47 140.84,64.15 142.49,62.5 P1.1 ; 105.28,111.14 109.86,115.71 v1(112.65,115.71) ; 105.28,84.85 105.41,84.98 v1(115.19,84.98)
  Bottom Layer w0.254: 83.44,134.79 v1(83.44,136.32) ; 85.34,82.22 86.71,83.58 v1(96.27,83.58) ; R23.2 89.03,106.95 v1(94.74,112.66) ; v1(112.65,115.71) 114.66,115.71 ; v1(115.19,84.98) 118.42,84.98 118.47,84.93
5V: length 161
  Top Layer w0.254: v1(117.98,36.66) 117.98,61.96 119.28,63.26 v1(137.92,63.26)
  Bottom Layer w0.254: U70.2 117.98,53.34 ; U69.2 117.98,43.56 ; v1(117.98,36.66) 117.98,11.57 ; 117.98,11.57 98.68,11.57 96.01,14.24 96.01,23.38 93.69,25.7 R92.2 89.59,25.7 88.32,26.97 86.72,26.97 U59.2 ; 117.98,11.57 134.37,11.57 139.7,6.24 139.7,3.44 ; U68.2 v1(119.36,63.26) ; U71.2 v1(131.05,63.27) ; U72.2 137.91,63.28 v1(137.92,63.26)
  Bottom Layer w1.5: U75.1 81.01,32.67 U59.2
  vias: v1(117.98,53.3) v1(117.98,43.58)
+15V: length 448.4
  Top Layer w0.5: 77.2,50.18 v1(77.2,59.32) ; U60.1 119,19.57 145.29,45.86 145.29,66.82 142.11,69.99 142.11,89.04 U47.2 141.93,95.72 141.93,117.93 144.75,120.74 U51.2
  Top Layer w1: U17.2 55.5,125.62 53.09,123.2 53.09,104.66 U66.2 53.09,93.99 53.09,78.37 U64.2 54.23,68.85 54.23,56.66 70.72,56.66 U60.1
  Top Layer w1.5: U24.9 107.8,16.1 U60.1
  Bottom Layer w0.254: U64.2 66.93,81.55 66.93,86.88 68.32,88.27 U77.1 83.33,89.07 C50.2 ; 77.25,63.08 79.45,63.08 80.04,63.67 ; 79.02,114.58 79.69,115.25 C51.2 84.5,115.25 85.47,116.22 85.47,123.32 86.04,123.89 U21.11 ; C52.2 87.12,63.75 88.12,64.75 88.12,70.99 88.73,71.6 U33.11 ; 85.17,88.99 91.14,88.99 91.69,89.55 91.69,96.41 92,96.72 U29.11 ; U46.11 130.1,90.72 130.51,90.31 133.99,90.31 134.37,90.7 138.79,90.7 U81.1 ; 129.16,120.66 130.58,119.24 C53.2 138.54,119.24 U80.1
  Bottom Layer w0.5: U66.2 72.4,113.31 77.75,113.31 79.02,114.58 ; v1(77.2,59.32) 77.25,59.38 77.25,63.08 ; U80.1 144.61,119.99 U51.2 ; U81.1 144.44,91.37 U47.2
GND: length 60
  Bottom Layer w0.254: v1(80.39,124.73) 80.82,125.16 U21.5 ; v1(82.55,72.53) 82.89,72.87 U33.5 ; v1(86.23,97.68) 86.54,97.99 U29.5 ; 91.51,121.99 v1(91.51,120.46) ; 93.17,70.34 v1(93.17,68.84) ; 93.54,117.06 v1(94.87,117.06) ; 94.95,65.8 v1(96.31,65.8) ; v1(95.88,95.26) 96.35,95.73 97.28,95.73 ; 98.99,91.25 v1(100.26,91.25) ; 119.89,123.75 v1(118.52,123.75) ; CN3.1 CN5.4 ; U53.5 127.99,114.34 v1(128.27,114.06) ; U46.5 128.83,85.05 v1(129.29,84.6) ; 130.98,125.49 130.98,124.18 v1(131.32,123.84) ; C32.2 132.46,96.05 v1(132.46,94.78) ; 135.25,127.46 v1(136.59,127.46) ; R78.1 v1(135.93,99.79) ; CN2.3 CN8.3 ; 138.97,82.57 144.76,82.57 U48.2 ; 139.01,111.02 144.76,111.02 U52.2 ; C48.2 139.16,111.09 ; C49.2 138.99,82.52
  vias: v1(91.61,58.52) v1(91.61,49.08) v1(91.61,40.06) v1(99.99,58.47) v1(99.99,49.08) v1(99.99,40.11) v1(106.43,136.21) v1(106.43,131.46) v1(113.79,136.16) v1(113.79,131.46)
$1N1815: length 11.1
  Bottom Layer w0.254: R93.1 69.52,118 R3.1 U17.1
$1N1976: length 8.9
  Top Layer w0.254: v1(79.12,123.8) v1(79.12,120.16)
  Bottom Layer w0.254: 79.12,125.08 v1(79.12,123.8) ; v1(79.12,120.16) 79.2,120.08 U21.1 U21.2
$1N2054: length 2.9
  Bottom Layer w0.254: U5.1 69.18,131.12 R5.2
$1N2080: length 2.9
  Bottom Layer w0.254: U5.2 71.72,131.12 R6.2
$1N2106: length 2.9
  Bottom Layer w0.254: U5.3 74.26,131.12 R7.2
$1N2182: length 2.9
  Bottom Layer w0.254: R8.2 76.8,131.12 U5.4
$1N3183: length 7.4
  Bottom Layer w0.254: U21.13 88.47,121.35 91.17,118.65 91.76,118.65 ; R13.1 R14.2
$1N3559: length 12.7
  Bottom Layer w0.254: 79.13,126.59 78.95,126.76 R8.1 R7.1 R6.1 R5.1 ; 79.12,126.51 79.2,126.43 U21.6
$1N6527: length 20.3
  Bottom Layer w0.254: R22.1 87.5,105.51 U26.5 U26.6 U26.7 U26.8 ; 87.46,102.96 87.71,102.71 U29.7
$1N6536: length 7.2
  Top Layer w0.254: v1(84.71,96.15) 84.71,94.88 v1(85.47,94.12)
  Bottom Layer w0.254: v1(84.71,96.15) 84.71,97.52 ; v1(85.47,94.12) 87.65,94.12 U29.2 U29.1
$1N6548: length 6.3
  Bottom Layer w0.254: U29.13 94.56,94.18 95.91,92.82 97.11,92.82 ; R27.2 98.98,92.78 R26.1
$1N7416: length 14.2
  Bottom Layer w0.254: 70.22,74.19 77.84,74.19 ; R34.1 83.99,74.23 84.18,74.05 U33.6
$1N7419: length 20.8
  Bottom Layer w0.254: U30.8 U30.5 83.87,79.88 83.87,78.66 ; R35.1 83.91,75.77 U33.7
$1N7428: length 8.5
  Top Layer w0.254: v1(80.77,71.26) 80.77,69.48 v1(81.79,68.59)
  Bottom Layer w0.254: R30.1 v1(80.77,71.26) ; v1(81.79,68.59) 82.25,69.06 U33.2 U33.1
$1N10154: length 2.6
  Bottom Layer w0.254: R72.2 U43.4
$1N10155: length 14.4
  Bottom Layer w0.254: U46.6 127.56,81.87 127.67,81.76 ; 127.67,81.76 129.56,81.76 R68.2 ; 127.67,81.76 127.67,74.14
$1N10157: length 2.6
  Bottom Layer w0.254: R71.2 U43.3
$1N10158: length 2.6
  Bottom Layer w0.254: R70.2 U43.2
$1N10180: length 2.6
  Bottom Layer w0.254: R69.2 U43.1
$1N10182: length 8
  Top Layer w0.254: v1(132.34,81.75) 133.91,83.32 v1(133.91,84.73)
  Bottom Layer w0.254: 131.11,81.75 v1(132.34,81.75) ; U46.2 U46.1 v1(133.91,84.73)
$1N20202: length 7.3
  Top Layer w0.254: v1(129.42,112.62) 130.3,112.62 v1(131.8,114.12)
  Bottom Layer w0.254: 128.19,112.62 v1(129.42,112.62) ; v1(131.8,114.12) U53.2 U53.1
$1N20203: length 2.9
  Bottom Layer w0.254: R81.2 120.19,104.96
$1N20204: length 2.9
  Bottom Layer w0.254: R82.2 120.19,107.5
$1N20205: length 2.9
  Bottom Layer w0.254: R83.2 120.19,110.04
$1N20206: length 2.9
  Bottom Layer w0.254: R84.2 120.19,112.58
$1N41685: length 9.5
  Bottom Layer w0.254: 68.83,65.39 66.8,65.39 ; R95.1 U64.1
$1N42087: length 10.9
  Bottom Layer w0.254: 69.22,91.58 R98.1 65.53,91.58 65.53,91.64 65.47,91.71 U66.1
$1N42100: length 20.9
  Bottom Layer w0.254: U29.3 87.69,95.46 C47.1 R99.2
$1N42167: length 16.4
  Bottom Layer w0.254: R100.2 138.77,108.7 C48.1 138.93,108.85 133.99,108.85 130.53,112.3 U53.3 130.53,116.63
$1N42233: length 13.5
  Bottom Layer w0.254: U46.3 131.37,85.05 136.01,80.42 138.96,80.42 ; R101.2 138.78,78.37 138.78,80.49 C49.1
-15V: length 470.6
  Top Layer w0.5: U61.2 98.7,13.46 102.74,9.41 128.4,9.41 147.83,28.84 147.83,84.75 U47.1 148.34,90.18 148.34,112.69 U51.1
  Bottom Layer w0.254: U64.3 67.44,89.68 78.61,89.68 80.52,91.58 82.24,91.58 U77.2 83.26,91.15 88.34,91.15 89.66,92.47 89.66,95.56 88.5,96.72 ; 77.25,66.68 79.2,66.68 80.04,65.83 ; U78.2 79.87,117.33 81.81,117.33 ; C52.1 80.15,65.86 81.85,65.86 82.66,65.04 85.47,65.04 85.85,65.42 85.85,71.27 85.52,71.6 U33.4 ; C51.1 83.45,118.89 83.45,123.7 81.94,123.7 U21.4 ; 130.1,87.47 130.1,87.89 131.15,88.94 134.06,88.94 134.45,88.55 136.66,88.55 ; 129.29,116.73 130.18,117.62 134.24,117.62 134.61,117.24 C53.1 138.43,117.24 U80.2 ; 136.67,88.62 138.62,88.62 U81.2
  Bottom Layer w0.5: U66.3 66.93,115.46 72.64,115.46 74.3,118 78.98,118 ; 73.41,51.2 73.41,65.17 74.95,66.71 U79.2 ; U80.2 144.64,116.39 U51.1 ; U81.2 144.8,87.77 U47.1
  Bottom Layer w1: U17.3 55.88,133.24 51.44,128.79 51.44,113.93 U66.3 56.01,106.95 51.69,102.63 51.69,87.39 U64.3 51.31,73.55 51.31,57.93 56.01,53.23 71.12,53.23 98.7,25.65 U61.2
  Bottom Layer w1.5: U61.2 98.7,18.64 U24.10
CS: length 2.8
  Bottom Layer w0.254: CN1.2 124.08,3.49 CN7.2
DINOUT: length 8.7
  Bottom Layer w0.254: 132.08,3.44 CN7.4 129.16,3.49 CN1.4 132.08,6.24
DRDY: length 2.8
  Bottom Layer w0.254: CN1.3 126.62,3.49 CN7.3
RST: length 2.8
  Bottom Layer w0.254: CN1.1 121.54,3.49 CN7.1
SCLK: length 2.8
  Bottom Layer w0.254: CN2.2 CN8.2
$1N2231: length 20.9
  Bottom Layer w0.254: U5.8 U5.5 81.95,133.59 81.95,131.16 81.75,130.96 U21.7
$1N2651: length 11.5
  Bottom Layer w0.254: 83.46,133.2 83.46,125.85 84.2,125.11 87.24,125.11 U21.10
$1N3069: length 6.6
  Bottom Layer w0.254: 91.51,127.67 91.91,127.67 93.91,125.67 93.91,124.14 ; 91.53,129.48 91.53,127.67
$1N3119: length 6.8
  Bottom Layer w0.254: U21.12 88.96,122.62 90.4,124.06 C1.1 ; 91.51,126.08 91.51,124.14
$1N4476: length 99.7
  Bottom Layer w0.254: U21.14 87.29,117.96 88.14,117.11 91.75,117.11 R13.2 ; 91.76,117.06 91.76,115.9 92.71,114.95 95.38,114.95 95.88,115.46 ; 93.92,121.99 95.88,120.02 95.88,115.46 ; 95.88,115.46 96.76,115.46 104.65,107.57 104.65,98.82 105.66,97.8 105.66,82.56 106.68,81.55 106.68,75.83 110.24,72.28 110.24,69.86 114.43,65.67 U68.3 117.36,55.75 119,54.12 120.94,54.12 CN4.2
$1N5599: length 9.5
  Top Layer w1.5: U57.1 14.62,61.75 U76.1
$1N5603: length 42.5
  Bottom Layer w1.5: U57.2 14.8,49.86 R113.1 22.65,34.79 12.32,24.46
$1N6524: length 13.2
  Bottom Layer w0.254: R18.1 R21.1 ; 82.17,99.12 87.57,99.12 U29.6
$1N6525: length 2.6
  Bottom Layer w0.254: U26.1 74.55,103.22 R18.2
$1N6528: length 2.5
  Bottom Layer w0.254: U26.3 79.63,103.22 79.63,100.71
$1N6529: length 2.5
  Bottom Layer w0.254: U26.2 77.09,103.22 77.09,100.71
$1N6533: length 2.5
  Bottom Layer w0.254: U26.4 82.17,103.22 82.17,100.71
$1N6538: length 10.7
  Bottom Layer w0.254: R22.2 89.03,102.98 89.03,105.01 ; 89.05,102.96 89.41,102.6 89.41,98.57 89.99,97.99 U29.10
$1N6541: length 80.1
  Bottom Layer w0.254: U29.14 93.25,91.81 93.82,91.23 97.11,91.23 97.11,90.74 98.43,89.42 100.46,89.42 101.35,90.31 101.35,93.81 99.57,95.58 ; 99.95,89.42 99.95,61.86 110.47,51.34 U70.3 114.44,51.32 124.46,51.32 126.62,53.48 CN4.3
$1N6553: length 6.9
  Bottom Layer w0.254: R24.2 97.28,103.13 97.28,101.27 98.28,101.27 99.69,99.85 C13.2
$1N6559: length 6.8
  Bottom Layer w0.254: U29.12 93.91,95.45 96.14,97.68 97.3,97.68 ; 97.28,99.68 97.28,97.82 C12.1
$1N7417: length 1.9
  Bottom Layer w0.254: 70.22,75.78 70.22,77.69
$1N7420: length 1.8
  Bottom Layer w0.254: 75.3,75.78 75.3,77.56
$1N7421: length 1.8
  Bottom Layer w0.254: 72.76,75.78 72.76,77.56
$1N7425: length 1.8
  Bottom Layer w0.254: 77.84,75.78 77.86,75.8 77.86,77.56
$1N7430: length 11
  Bottom Layer w0.254: 85.38,78.65 85.38,80.63 ; 85.46,78.66 86.23,77.89 86.23,73.93 87.29,72.87 U33.10
$1N7440: length 5.9
  Bottom Layer w0.254: U33.13 90.72,69.06 91.8,67.98 92.42,67.98 R39.1 R40.2
$1N7445: length 6.9
  Bottom Layer w0.254: R37.2 93.21,75.94 94,75.94 95.6,74.34 C18.2
$1N7451: length 6.1
  Bottom Layer w0.254: 89.77,70.33 91.01,70.33 93.17,72.5 93.17,74.27 93.22,74.31
$1N10156: length 20.6
  Bottom Layer w0.254: U43.8 U43.5 121.61,81.76 123.32,83.47 R73.1 ; 123.36,84.93 125.3,84.93 126.37,85.99
$1N10167: length 7.1
  Bottom Layer w0.254: R75.2 124.39,96.65 126.26,96.65 ; R76.1 126.26,96.69 126.26,97.7 127.62,99.06 C33.2
$1N10186: length 7.1
  Bottom Layer w0.254: U46.13 132.64,93.03 133.86,94.25 133.86,96.1 134.38,96.62 134.38,98.55
$1N10198: length 7.1
  Bottom Layer w0.254: 129.78,96.65 129.78,95.91 131.32,94.38 131.32,92.23 U46.12 ; C32.1 127.85,96.65
$1N10199: length 12.5
  Bottom Layer w0.254: 121.77,84.93 120.06,84.93 ; R73.2 125.16,88.28 127.25,88.28 128.78,89.8 128.78,91.58
$1N17336: length 28
  Top Layer w1.5: 12.32,41.96 18.42,48.06 18.42,57.42 24.79,57.42 R113.2 24.47,57.73 24.47,60.74
$1N20207: length 22.6
  Bottom Layer w0.254: U49.8 U49.5 117.82,112.58 119.58,114.34 119.58,115.64 119.62,115.69 125.27,115.69 U53.7
$1N20209: length 15.3
  Bottom Layer w0.254: R86.1 116.23,115.69 R85.2 ; 118.03,115.69 120.34,118 127.63,118 128.02,118.38 128.02,120.66
$1N20211: length 6.9
  Bottom Layer w0.254: 123.51,125.26 123.53,125.24 125.26,125.24 125.26,126 127.22,127.97 128.81,127.97
$1N20212: length 6.1
  Bottom Layer w0.254: 126.85,125.24 128.58,125.24 128.82,125.49 ; C37.1 128.9,124.48 130.56,122.82 130.56,122.19
$1N20213: length 6.8
  Bottom Layer w0.254: U53.13 131.8,122.64 133.55,124.39 133.55,125.57 133.66,125.68 133.66,127.46
$1N20216: length 12.2
  Bottom Layer w0.254: 124.55,104.96 124.55,112.58 126.6,112.58 ; 126.75,115.08 126.64,114.97 R80.2
$1N20370: length 7.8
  Top Layer w1.5: U55.1 12.19,83.45 R2.1
$1N20734: length 5.9
  Bottom Layer w0.254: U59.1 92.13,20.19 ; R91.2 R92.1
$1N23806: length 33.1
  Top Layer w1.5: 59.32,14.46 66.53,7.25 C44.2 78.9,3.92 U24.1
$1N36258: length 18.9
  Top Layer w1.5: 59.32,34.2 65.74,27.79 L4.1
$1N36284: length 37
  Top Layer w1.5: C44.1 L4.2
  Bottom Layer w1.5: U74.1 71.63,26.72 L4.2 81.76,22.79 U59.3 84.36,17.73 U24.16
$1N41392: length 14.8
  Bottom Layer w0.254: 69.6,119.52 69.47,119.65 69.47,121.49 78.93,121.49 80.01,122.57 81.7,122.57 U21.3
$1N41681: length 18
  Bottom Layer w0.254: R96.2 68.83,68.91 ; 68.83,68.99 79.9,68.99 81.24,70.33 U33.3
$1N41683: length 83.3
  Top Layer w1.5: U17.5 40.39,115.71 40.39,94.12 38.1,91.84 U66.5 40.39,89.42 40.39,67.45 38.35,65.42 U64.5
  Bottom Layer w1.5: U64.5 U67.2
$1N42093: length 22.4
  Top Layer w1.5: R97.2 32.79,106.95 U66.4
$1N42170: length 6.6
  Bottom Layer w0.254: R100.1 145.32,105.38 U52.1
$1N42236: length 6.7
  Bottom Layer w0.254: 138.72,76.76 145.24,76.76 U48.1
$1N84415: length 42.1
  Bottom Layer w1.5: R94.2 29.08,95.26 32.89,91.45 32.89,85.87 U64.4
$1N84418: length 23
  Bottom Layer w1.5: U55.2 16.53,77.48 R94.1
$1N84441: length 31.8
  Top Layer w1.5: R2.2 26.39,133.24 U17.4
$1N84474: length 23.4
  Top Layer w1.5: R97.1 20.7,79.9 U67.1
$1N102670: length 83.3
  Bottom Layer w0.254: 93.05,65.8 90.17,65.8 89.81,66.16 U33.14 89.85,67.75 90.57,67.75 ; R39.2 93.05,65.34 94.49,63.89 97.03,63.89 97.79,64.66 97.79,68.15 95.6,70.34 ; 96.27,63.89 96.27,48.53 103.24,41.56 U69.3 ; 114.35,41.48 114.49,41.42 122.3,41.42 131.19,50.31 131.19,55.22 CN4.4
$1N108532: length 92.6
  Bottom Layer w0.254: C33.1 133.65,100.85 137.03,100.85 137.67,100.22 137.67,97.42 ; U46.14 135.97,94.24 135.97,96.62 136.87,96.62 137.67,97.42 ; U72.3 135.89,65.69 135.89,69.48 137.16,70.75 144.53,70.75 148.34,74.56 148.34,95.52 146.43,97.42 137.67,97.42 ; 135.9,65.67 135.9,63.23 136.92,62.2 143.42,62.2 144.78,60.72 144.78,56.15 142.88,54.24 141.35,54.24 139.7,55.89 139.7,57.26
$1N108540: length 137.5
  Bottom Layer w0.254: CN4.1 120.3,57.26 119.13,58.43 119.13,61.36 119.51,61.74 126.95,61.74 129.05,63.83 U71.3 123.46,71.26 115.7,71.26 112.01,74.94 112.01,102.12 108.84,105.3 108.84,121.81 117.86,130.82 130.08,130.82 130.97,129.94 130.97,127.97 133.31,130.32 137.41,130.32 138.81,128.92 138.81,126.76 137.73,125.68 135.25,125.68 135.25,122.06 134.62,121.43 133.09,121.43 U53.14
$1N114348: length 9.8
  Bottom Layer w0.254: U21.9 85.93,126.43 85.34,127.01 85.34,128.79 87.88,131.33 88.33,131.33 88.33,133.11
$1N114352: length 5.3
  Bottom Layer w0.254: U21.8 89.07,129.48 R11.1 ; R114.2 89.94,131.27 89.94,129.48
$1N114492: length 10.3
  Bottom Layer w0.254: U29.9 91.89,99.26 91.31,99.84 91.31,101.11 92.2,102 92.2,103.08 94.17,105.04 94.17,106.81
$1N114496: length 5.5
  Bottom Layer w0.254: U29.8 93.25,100.66 95.72,103.14 95.72,105.04 95.72,105.04
$1N114708: length 10.5
  Bottom Layer w0.254: 120.78,93.45 122.56,93.45 122.56,90.56 123.06,90.06 125.98,90.06 127.51,91.58
$1N114712: length 5.5
  Bottom Layer w0.254: 122.56,95.09 124.38,95.09 124.38,94.08 U46.8
$1N114721: length 10.2
  Bottom Layer w0.254: R121.2 121.66,122.2 ; 121.67,122.16 121.67,119.65 122.17,119.14 125.22,119.14 126.75,120.66
$1N114725: length 5
  Bottom Layer w0.254: R120.2 121.67,123.71 123.51,123.71 123.51,123.35 U53.8
$1N114740: length 9.8
  Bottom Layer w0.254: U33.9 88.69,74.14 88.01,74.82 88.01,76.59 90.14,78.72 90.14,81.67
$1N114744: length 5.3
  Bottom Layer w0.254: U33.8 89.81,75.97 R37.1 91.7,79.88 R118.2

## Copper pours and planes (outline as drawn; the poured copper is in the pictures)
GND on Top Layer: 61.47,139.08 148.34,139.08 148.34,2.55 61.47,2.55
GND on Bottom Layer: 61.47,139.08 148.34,139.08 148.34,2.55 61.47,2.55
